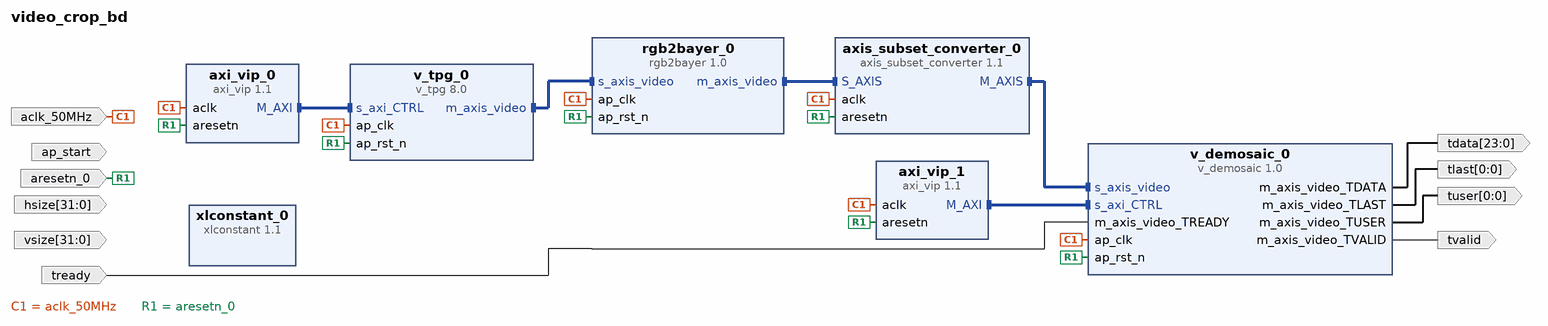
[diagram p0: block diagram of the top level]
# Vivado block design video_crop_bd, xc7z020clg484-1, Vivado 2018.3
create_bd_design video_crop_bd

create_bd_port -dir I -type clk aclk_50MHz
set_property -dict {CONFIG.FREQ_HZ 50000000} [get_bd_ports aclk_50MHz]
create_bd_port -dir I ap_start
create_bd_port -dir I -type rst aresetn_0
create_bd_port -dir I -from 31 -to 0 -type data hsize
set_property -dict [list \
  CONFIG.LAYERED_METADATA {xilinx.com:interface:datatypes:1.0 {DATA {datatype {name {attribs {resolve_type immediate dependency {} format string minimum {} maximum {}} value {}} bitwidth {attribs {resolve_type immediate dependency {} format long minimum {} maximum {}} value 32} bitoffset {attribs {resolve_type immediate dependency {} format long minimum {} maximum {}} value 0} integer {signed {attribs {resolve_type immediate dependency {} format bool minimum {} maximum {}} value true}}}}}} \
] [get_bd_ports hsize]
create_bd_port -dir O -from 23 -to 0 tdata
create_bd_port -dir O -from 0 -to 0 tlast
create_bd_port -dir I tready
create_bd_port -dir O -from 0 -to 0 tuser
create_bd_port -dir O tvalid
create_bd_port -dir I -from 31 -to 0 -type data vsize
set_property -dict [list \
  CONFIG.LAYERED_METADATA {xilinx.com:interface:datatypes:1.0 {DATA {datatype {name {attribs {resolve_type immediate dependency {} format string minimum {} maximum {}} value {}} bitwidth {attribs {resolve_type immediate dependency {} format long minimum {} maximum {}} value 32} bitoffset {attribs {resolve_type immediate dependency {} format long minimum {} maximum {}} value 0} integer {signed {attribs {resolve_type immediate dependency {} format bool minimum {} maximum {}} value true}}}}}} \
] [get_bd_ports vsize]

create_bd_cell -type ip -vlnv xilinx.com:ip:axi_vip:1.1 axi_vip_0
set_property -dict [list \
  CONFIG.ADDR_WIDTH 12 \
  CONFIG.DATA_WIDTH 32 \
  CONFIG.HAS_BRESP 1 \
  CONFIG.HAS_PROT 1 \
  CONFIG.HAS_RRESP 1 \
  CONFIG.HAS_WSTRB 1 \
  CONFIG.INTERFACE_MODE MASTER \
  CONFIG.PROTOCOL AXI4LITE \
  CONFIG.READ_WRITE_MODE READ_WRITE \
] [get_bd_cells axi_vip_0]
create_bd_cell -type ip -vlnv xilinx.com:ip:axi_vip:1.1 axi_vip_1
set_property -dict [list \
  CONFIG.ADDR_WIDTH 12 \
  CONFIG.DATA_WIDTH 32 \
  CONFIG.HAS_BRESP 1 \
  CONFIG.HAS_PROT 1 \
  CONFIG.HAS_RRESP 1 \
  CONFIG.HAS_WSTRB 1 \
  CONFIG.INTERFACE_MODE MASTER \
  CONFIG.PROTOCOL AXI4LITE \
  CONFIG.READ_WRITE_MODE READ_WRITE \
] [get_bd_cells axi_vip_1]
create_bd_cell -type ip -vlnv xilinx.com:ip:axis_subset_converter:1.1 axis_subset_converter_0
create_bd_cell -type ip -vlnv xilinx.com:hls:rgb2bayer:1.0 rgb2bayer_0
set_property -dict {CONFIG.MAXIMUM_NUMBER_OF_COLUMNS 480 CONFIG.MAXIMUM_NUMBER_OF_ROWS 640} [get_bd_cells rgb2bayer_0]
create_bd_cell -type ip -vlnv xilinx.com:ip:v_demosaic:1.0 v_demosaic_0
set_property -dict {CONFIG.MAX_DATA_WIDTH 8 CONFIG.SAMPLES_PER_CLOCK 1} [get_bd_cells v_demosaic_0]
create_bd_cell -type ip -vlnv xilinx.com:ip:v_tpg:8.0 v_tpg_0
set_property -dict {CONFIG.MAX_DATA_WIDTH 8 CONFIG.SAMPLES_PER_CLOCK 1} [get_bd_cells v_tpg_0]
create_bd_cell -type ip -vlnv xilinx.com:ip:xlconstant:1.1 xlconstant_0
set_property -dict {CONFIG.CONST_VAL 0 CONFIG.CONST_WIDTH 2} [get_bd_cells xlconstant_0]

# ---- connections ----

connect_bd_intf_net [get_bd_intf_pins axi_vip_0/M_AXI] [get_bd_intf_pins v_tpg_0/s_axi_CTRL]
connect_bd_intf_net [get_bd_intf_pins axis_subset_converter_0/S_AXIS] [get_bd_intf_pins rgb2bayer_0/m_axis_video]
connect_bd_intf_net [get_bd_intf_pins axis_subset_converter_0/M_AXIS] [get_bd_intf_pins v_demosaic_0/s_axis_video]
connect_bd_intf_net [get_bd_intf_pins axi_vip_1/M_AXI] [get_bd_intf_pins v_demosaic_0/s_axi_CTRL]
connect_bd_intf_net [get_bd_intf_pins rgb2bayer_0/s_axis_video] [get_bd_intf_pins v_tpg_0/m_axis_video]
connect_bd_net -net aclk_0_1 [get_bd_ports aclk_50MHz] \
  [get_bd_pins axi_vip_0/aclk] [get_bd_pins axi_vip_1/aclk] [get_bd_pins axis_subset_converter_0/aclk] \
  [get_bd_pins rgb2bayer_0/ap_clk] [get_bd_pins v_demosaic_0/ap_clk] [get_bd_pins v_tpg_0/ap_clk]
# net ap_start_1 has one end: ap_start
connect_bd_net -net aresetn_0_1 [get_bd_ports aresetn_0] \
  [get_bd_pins axi_vip_0/aresetn] [get_bd_pins axi_vip_1/aresetn] [get_bd_pins axis_subset_converter_0/aresetn] \
  [get_bd_pins rgb2bayer_0/ap_rst_n] [get_bd_pins v_demosaic_0/ap_rst_n] [get_bd_pins v_tpg_0/ap_rst_n]
connect_bd_net [get_bd_ports tready] [get_bd_pins v_demosaic_0/m_axis_video_TREADY]
connect_bd_net [get_bd_pins v_demosaic_0/m_axis_video_TDATA] [get_bd_ports tdata]
connect_bd_net [get_bd_pins v_demosaic_0/m_axis_video_TLAST] [get_bd_ports tlast]
connect_bd_net [get_bd_pins v_demosaic_0/m_axis_video_TUSER] [get_bd_ports tuser]
connect_bd_net [get_bd_pins v_demosaic_0/m_axis_video_TVALID] [get_bd_ports tvalid]

# ---- address map ----
assign_bd_address -offset 0x000 -range 4K -target_address_space [get_bd_addr_spaces axi_vip_0/Master_AXI] [get_bd_addr_segs v_tpg_0/s_axi_CTRL/Reg]
assign_bd_address -offset 0x000 -range 4K -target_address_space [get_bd_addr_spaces axi_vip_1/Master_AXI] [get_bd_addr_segs v_demosaic_0/s_axi_CTRL/Reg]

validate_bd_design
save_bd_design
